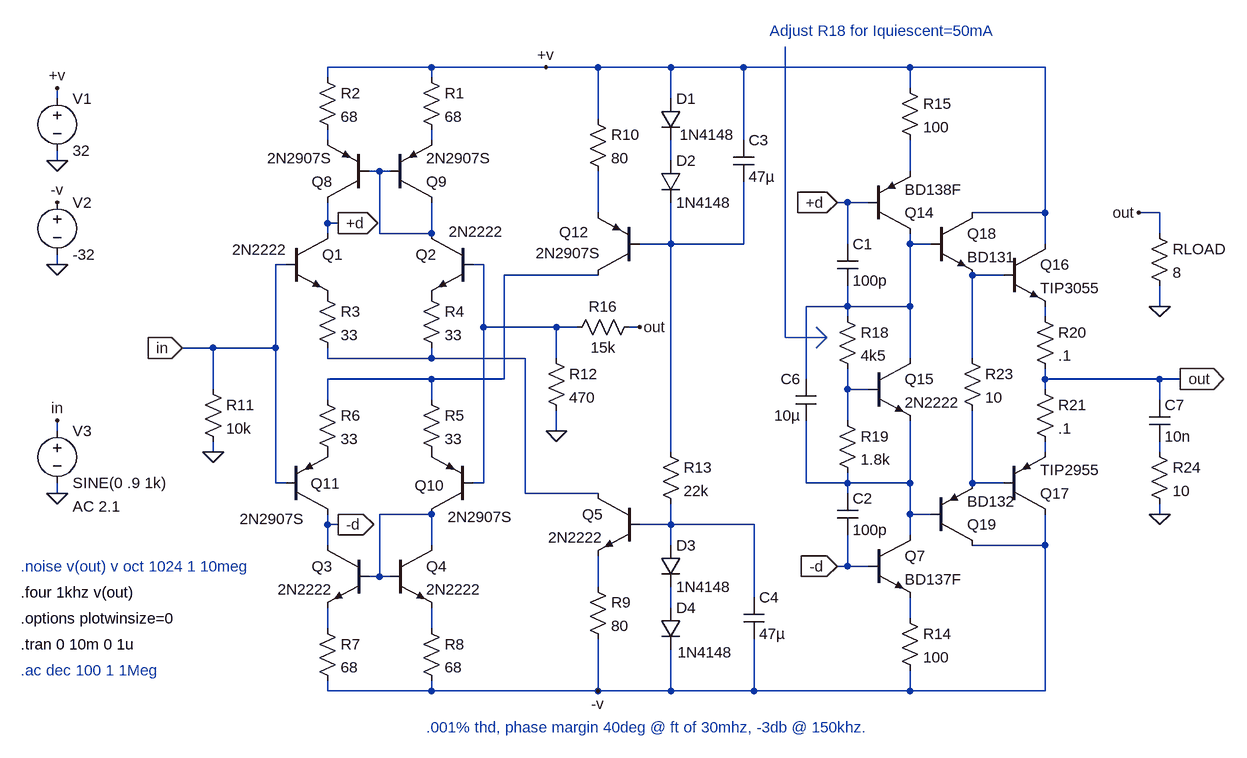
[diagram p0: schematic 30v_40w_Hifi_Amp.asc]
30v_40w_Hifi_Amp.asc, the LTspice schematic file:
Version 4
SHEET 1 6296 936
WIRE 80 -224 -80 -224
WIRE 256 -224 80 -224
WIRE 336 -224 256 -224
WIRE 448 -224 336 -224
WIRE 560 -224 448 -224
WIRE 816 -224 560 -224
WIRE 1024 -224 816 -224
WIRE -80 -208 -80 -224
WIRE 80 -208 80 -224
WIRE 816 -192 816 -224
WIRE -496 -176 -496 -192
WIRE 448 -176 448 -224
WIRE 336 -144 336 -224
WIRE -80 -112 -80 -128
WIRE 80 -112 80 -128
WIRE 560 -112 560 -224
WIRE -496 -80 -496 -96
WIRE 448 -80 448 -112
WIRE 0 -64 -16 -64
WIRE 16 -64 0 -64
WIRE 816 -64 816 -112
WIRE 720 -16 704 -16
WIRE 752 -16 720 -16
WIRE 336 0 336 -64
WIRE 1024 0 1024 -224
WIRE 1024 0 912 0
WIRE 1200 0 1168 0
WIRE -80 16 -80 -16
WIRE -64 16 -80 16
WIRE -80 32 -80 16
WIRE 0 32 0 -64
WIRE 80 32 80 -16
WIRE 80 32 0 32
WIRE 1200 32 1200 0
WIRE 448 48 448 -16
WIRE 448 48 400 48
WIRE 560 48 560 -48
WIRE 560 48 448 48
WIRE 720 48 720 -16
WIRE 816 48 816 32
WIRE 848 48 816 48
WIRE 1024 48 1024 0
WIRE -496 80 -496 64
WIRE -144 80 -160 80
WIRE 160 80 144 80
WIRE 336 96 192 96
WIRE 960 96 912 96
WIRE 720 144 720 112
WIRE 720 144 656 144
WIRE 816 144 816 48
WIRE 816 144 720 144
WIRE 1200 144 1200 112
WIRE 720 160 720 144
WIRE 1024 160 1024 144
WIRE 160 176 160 80
WIRE 272 176 160 176
WIRE 304 176 272 176
WIRE 400 176 384 176
WIRE -256 208 -304 208
WIRE -160 208 -160 80
WIRE -160 208 -256 208
WIRE -80 224 -80 208
WIRE 80 224 80 208
WIRE 80 224 -80 224
WIRE 224 224 80 224
WIRE 272 224 272 176
WIRE 816 224 816 144
WIRE 912 224 912 96
WIRE 80 256 -80 256
WIRE 192 256 192 96
WIRE 192 256 80 256
WIRE 656 256 656 144
WIRE 1024 256 1024 240
WIRE 1200 256 1024 256
WIRE 1232 256 1200 256
WIRE -256 272 -256 208
WIRE 720 272 720 240
WIRE 752 272 720 272
WIRE 1024 272 1024 256
WIRE -80 288 -80 256
WIRE 80 288 80 256
WIRE 1200 288 1200 256
WIRE 720 320 720 272
WIRE -496 336 -496 320
WIRE 272 336 272 304
WIRE -256 368 -256 352
WIRE 448 368 448 48
WIRE 1024 368 1024 352
WIRE 1200 368 1200 352
WIRE -160 416 -160 208
WIRE -144 416 -160 416
WIRE 160 416 160 176
WIRE 160 416 144 416
WIRE 656 416 656 320
WIRE 720 416 720 400
WIRE 720 416 656 416
WIRE 816 416 816 320
WIRE 816 416 720 416
WIRE 912 416 912 304
WIRE 960 416 912 416
WIRE -496 432 -496 416
WIRE 224 432 224 224
WIRE 336 432 224 432
WIRE 720 432 720 416
WIRE 80 464 0 464
WIRE 816 464 816 416
WIRE 848 464 816 464
WIRE 1200 464 1200 448
WIRE -80 480 -80 464
WIRE -64 480 -80 480
WIRE 448 480 448 448
WIRE 448 480 400 480
WIRE 576 480 448 480
WIRE 816 496 816 464
WIRE -80 512 -80 480
WIRE 80 512 80 464
WIRE 448 512 448 480
WIRE 1024 512 1024 464
WIRE 1024 512 912 512
WIRE 720 544 720 496
WIRE 720 544 704 544
WIRE 752 544 720 544
WIRE 0 560 0 464
WIRE 0 560 -16 560
WIRE 16 560 0 560
WIRE 336 576 336 528
WIRE 576 592 576 480
WIRE 448 608 448 576
WIRE 816 624 816 592
WIRE -80 640 -80 608
WIRE 80 640 80 608
WIRE -80 736 -80 720
WIRE 80 736 80 720
WIRE 80 736 -80 736
WIRE 336 736 336 656
WIRE 336 736 80 736
WIRE 448 736 448 672
WIRE 448 736 336 736
WIRE 576 736 576 656
WIRE 576 736 448 736
WIRE 816 736 816 704
WIRE 816 736 576 736
WIRE 1024 736 1024 512
WIRE 1024 736 816 736
FLAG -64 480 -d
IOPIN -64 480 Out
FLAG 704 544 -d
IOPIN 704 544 In
FLAG -64 16 +d
IOPIN -64 16 Out
FLAG 704 -16 +d
IOPIN 704 -16 In
FLAG 272 336 0
FLAG -256 368 0
FLAG -496 -80 0
FLAG -496 80 0
FLAG -496 432 0
FLAG -496 320 in
FLAG -304 208 in
IOPIN -304 208 In
FLAG 256 -224 +v
FLAG -496 -192 +v
FLAG -496 -16 -v
FLAG 336 736 -v
FLAG 1232 256 out
IOPIN 1232 256 Out
FLAG 400 176 out
FLAG 1200 144 0
FLAG 1168 0 out
FLAG 1200 464 0
SYMBOL npn -144 32 R0
WINDOW 3 -83 25 Left 0
SYMATTR Value 2N2222
SYMATTR InstName Q1
SYMBOL npn 144 32 M0
WINDOW 3 -47 -3 Left 0
SYMATTR Value 2N2222
SYMATTR InstName Q2
SYMBOL npn -16 512 M0
SYMATTR InstName Q3
SYMATTR Value 2N2222
SYMBOL npn 16 512 R0
SYMATTR InstName Q4
SYMATTR Value 2N2222
SYMBOL npn 400 432 M0
SYMATTR InstName Q5
SYMATTR Value 2N2222
SYMBOL npn 752 496 R0
SYMATTR InstName Q7
SYMATTR Value BD137F
SYMBOL pnp -16 -16 R180
SYMATTR InstName Q8
SYMATTR Value 2N2907S
SYMBOL pnp 16 -16 M180
SYMATTR InstName Q9
SYMATTR Value 2N2907S
SYMBOL pnp 144 464 R180
WINDOW 0 44 44 Left 0
WINDOW 3 -61 -4 Left 0
SYMATTR InstName Q10
SYMATTR Value 2N2907S
SYMBOL pnp -144 464 M180
WINDOW 0 38 47 Left 0
WINDOW 3 -71 -7 Left 0
SYMATTR InstName Q11
SYMATTR Value 2N2907S
SYMBOL pnp 400 96 R180
WINDOW 0 78 66 Left 0
WINDOW 3 59 34 Left 0
SYMATTR InstName Q12
SYMATTR Value 2N2907S
SYMBOL pnp 752 32 M180
SYMATTR InstName Q14
SYMATTR Value BD138F
SYMBOL diode 432 -176 R0
WINDOW 3 30 56 Left 0
SYMATTR Value 1N4148
SYMATTR InstName D1
SYMBOL diode 432 -80 R0
SYMATTR InstName D2
SYMATTR Value 1N4148
SYMBOL diode 432 512 R0
SYMATTR InstName D3
SYMATTR Value 1N4148
SYMBOL diode 432 608 R0
WINDOW 3 27 69 Left 0
SYMATTR Value 1N4148
SYMATTR InstName D4
SYMBOL res 64 -224 R0
SYMATTR InstName R1
SYMATTR Value 68
SYMBOL res -96 -224 R0
SYMATTR InstName R2
SYMATTR Value 68
SYMBOL res -96 112 R0
SYMATTR InstName R3
SYMATTR Value 33
SYMBOL res 64 112 R0
SYMATTR InstName R4
SYMATTR Value 33
SYMBOL res 64 272 R0
SYMATTR InstName R5
SYMATTR Value 33
SYMBOL res -96 272 R0
SYMATTR InstName R6
SYMATTR Value 33
SYMBOL res -96 624 R0
SYMATTR InstName R7
SYMATTR Value 68
SYMBOL res 64 624 R0
SYMATTR InstName R8
SYMATTR Value 68
SYMBOL res 320 560 R0
SYMATTR InstName R9
SYMATTR Value 80
SYMBOL res 320 -160 R0
SYMATTR InstName R10
SYMATTR Value 80
SYMBOL res -272 256 R0
SYMATTR InstName R11
SYMATTR Value 10k
SYMBOL res 256 208 R0
SYMATTR InstName R12
SYMATTR Value 470
SYMBOL res 432 352 R0
SYMATTR InstName R13
SYMATTR Value 22k
SYMBOL res 800 608 R0
SYMATTR InstName R14
SYMATTR Value 100
SYMBOL res 800 -208 R0
SYMATTR InstName R15
SYMATTR Value 100
SYMBOL res 400 160 R90
WINDOW 0 0 56 VBottom 0
WINDOW 3 32 56 VTop 0
SYMATTR InstName R16
SYMATTR Value 15k
SYMBOL cap 544 -48 M180
WINDOW 0 24 64 Left 0
WINDOW 3 24 8 Left 0
SYMATTR InstName C3
SYMATTR Value 47µ
SYMBOL cap 560 656 M180
WINDOW 0 24 64 Left 0
WINDOW 3 24 8 Left 0
SYMATTR InstName C4
SYMATTR Value 47µ
SYMBOL voltage -496 -192 R0
WINDOW 123 0 0 Left 0
WINDOW 39 0 0 Left 0
SYMATTR InstName V1
SYMATTR Value 32
SYMBOL voltage -496 -32 R0
WINDOW 123 0 0 Left 0
WINDOW 39 0 0 Left 0
SYMATTR InstName V2
SYMATTR Value -32
SYMBOL voltage -496 320 R0
WINDOW 123 24 132 Left 0
WINDOW 39 0 0 Left 0
SYMATTR Value2 AC 2.1
SYMATTR InstName V3
SYMATTR Value SINE(0 .9 1k)
SYMBOL cap 704 112 M180
WINDOW 0 24 64 Left 0
WINDOW 3 24 8 Left 0
SYMATTR InstName C1
SYMATTR Value 100p
SYMBOL cap 704 432 R0
SYMATTR InstName C2
SYMATTR Value 100p
SYMBOL npn 752 224 R0
SYMATTR InstName Q15
SYMATTR Value 2N2222
SYMBOL cap 672 320 R180
WINDOW 0 24 64 Left 0
WINDOW 3 24 8 Left 0
SYMATTR InstName C6
SYMATTR Value 10µ
SYMBOL res 704 144 R0
SYMATTR InstName R18
SYMATTR Value 4k5
SYMBOL res 704 304 R0
SYMATTR InstName R19
SYMATTR Value 1.8k
SYMBOL npn 960 48 R0
SYMATTR InstName Q16
SYMATTR Value TIP3055
SYMBOL pnp 960 464 M180
SYMATTR InstName Q17
SYMATTR Value TIP2955
SYMBOL res 1008 144 R0
SYMATTR InstName R20
SYMATTR Value .1
SYMBOL res 1008 256 R0
SYMATTR InstName R21
SYMATTR Value .1
SYMBOL res 1184 16 R0
SYMATTR InstName RLOAD
SYMATTR Value 8
SYMBOL npn 848 0 R0
SYMATTR InstName Q18
SYMATTR Value BD131
SYMBOL pnp 848 512 M180
SYMATTR InstName Q19
SYMATTR Value BD132
SYMBOL res 896 208 R0
SYMATTR InstName R23
SYMATTR Value 10
SYMBOL res 1184 352 R0
SYMATTR InstName R24
SYMATTR Value 10
SYMBOL cap 1184 288 R0
SYMATTR InstName C7
SYMATTR Value 10n
TEXT -552 584 Left 0 !.four 1khz v(out)
TEXT -552 624 Left 0 !.options plotwinsize=0
TEXT -552 664 Left 0 !.tran 0 10m 0 1u
TEXT -552 704 Left 0 ;.ac dec 100 1 1Meg
TEXT 72 792 Left 0 ;.001% thd, phase margin 40deg @ ft of 30mhz, -3db @ 150khz.
TEXT -552 544 Left 0 ;.noise v(out) v oct 1024 1 10meg
TEXT 600 -280 Left 0 ;Adjust R18 for Iquiescent=50mA
LINE Normal 624 192 624 -256
LINE Normal 688 192 624 192
LINE Normal 672 176 688 192
LINE Normal 672 176 672 176
LINE Normal 688 192 672 176
LINE Normal 672 208 688 192
LINE Normal 672 208 672 208

The netlist it stands for:
* 30v_40w_Hifi_Amp.asc
Q1 +d in P001 0 2N2222
Q2 N004 N009 P002 0 2N2222
Q3 -d N019 N024 0 2N2222
Q4 N019 N019 N025 0 2N2222
Q5 N013 N020 N021 0 2N2222
Q7 N017 -d N023 0 BD137F
Q8 +d N004 N001 0 2N2907S
Q9 N004 N004 N002 0 2N2907S
Q10 N019 N009 P003 0 2N2907S
Q11 -d in P004 0 2N2907S
Q12 N010 N007 N006 0 2N2907S
Q14 N008 +d N005 0 BD138F
D1 +v N003 1N4148
D2 N003 N007 1N4148
D3 N020 N022 1N4148
D4 N022 -v 1N4148
R1 +v N002 68
R2 +v N001 68
R3 P001 N013 33
R4 P002 N013 33
R5 N010 P003 33
R6 N010 P004 33
R7 N024 -v 68
R8 N025 -v 68
R9 N021 -v 80
R10 +v N006 80
R11 in 0 10k
R12 N009 0 470
R13 N007 N020 22k
R14 N023 -v 100
R15 +v N005 100
R16 out N009 15k
C3 N007 +v 47µ
C4 -v N020 47µ
V1 +v 0 32
V2 -v 0 -32
V3 in 0 SINE(0 .9 1k) AC 2.1
C1 N008 +d 100p
C2 N017 -d 100p
Q15 N008 N014 N017 0 2N2222
C6 N017 N008 10µ
R18 N008 N014 4k5
R19 N014 N017 1.8k
Q16 +v N011 N012 0 TIP3055
Q17 -v N018 N015 0 TIP2955
R20 N012 out .1
R21 out N015 .1
RLOAD out 0 8
Q18 +v N008 N011 0 BD131
Q19 -v N017 N018 0 BD132
R23 N011 N018 10
R24 N016 0 10
C7 out N016 10n
.model D D
.lib standard.dio
.model NPN NPN
.model PNP PNP
.lib standard.bjt
.four 1khz v(out)
.options plotwinsize=0
.tran 0 10m 0 1u
* .ac dec 100 1 1Meg
* .001% thd, phase margin 40deg @ ft of 30mhz, -3db @ 150khz.
* .noise v(out) v oct 1024 1 10meg
* Adjust R18 for Iquiescent=50mA
.backanno
.end